# EAGLE board RFfrontend_v4 (EAGLE 7.5.0)
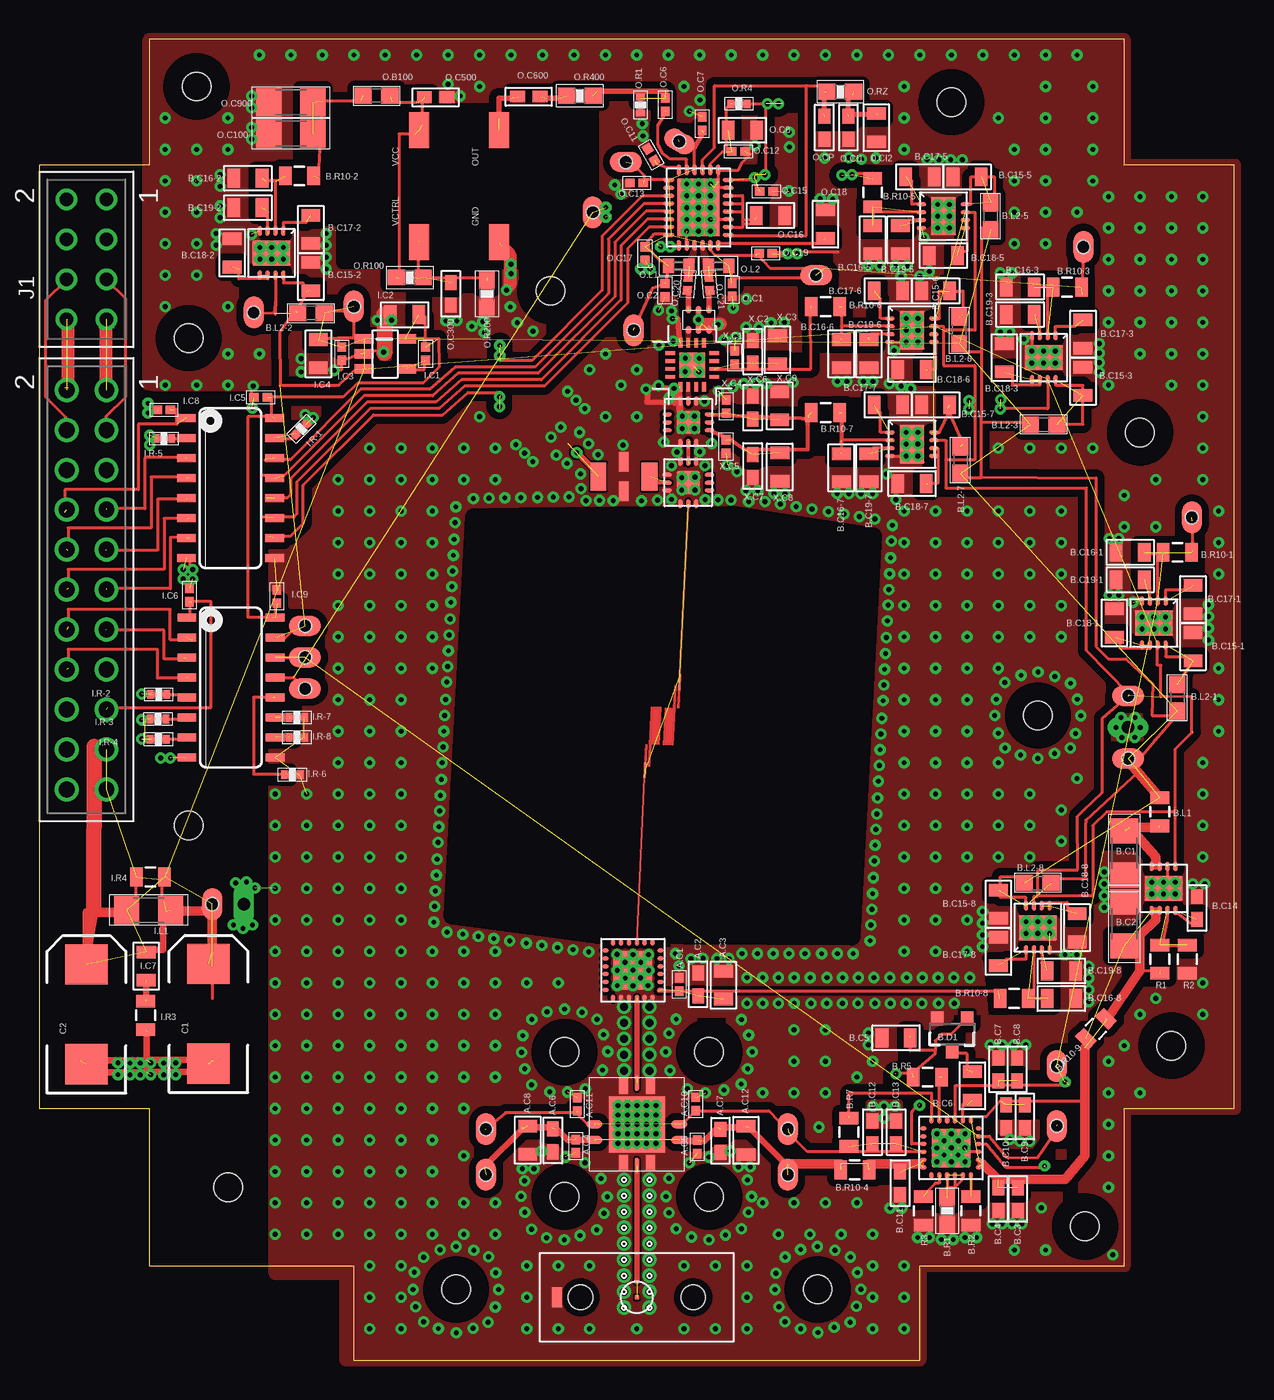
[diagram p2: board, top side]
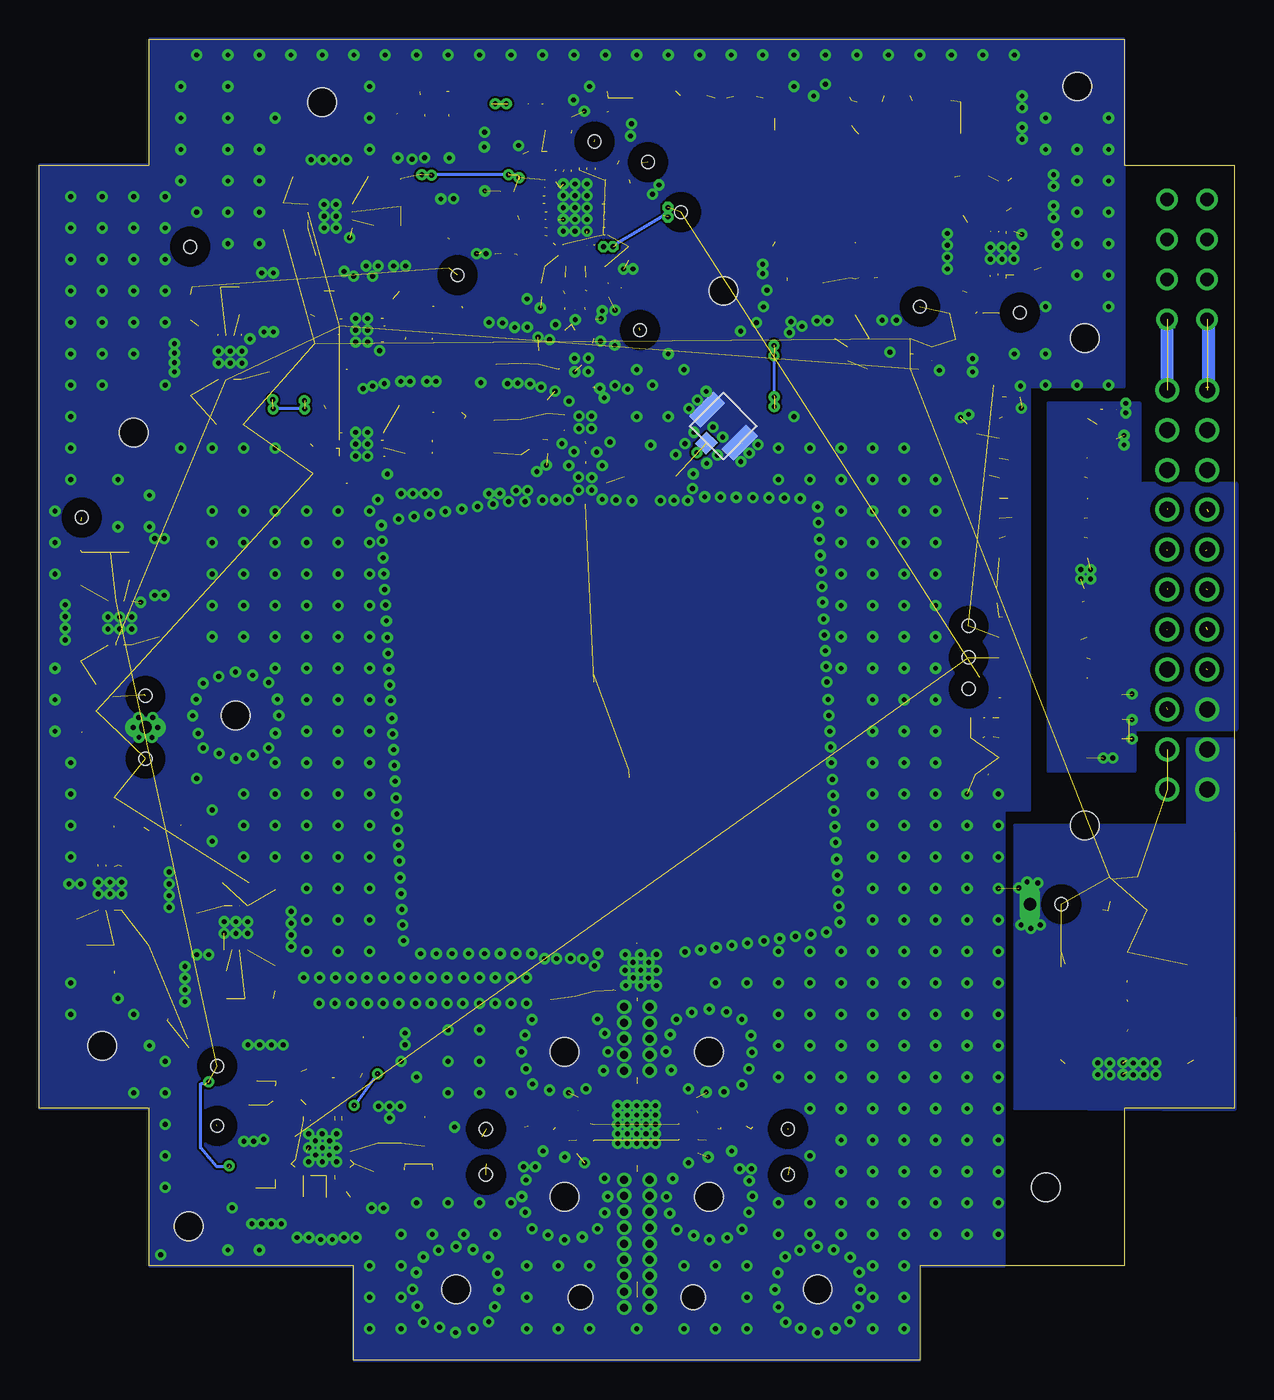
[diagram p3: board, bottom side, seen from below]

Size 76 x 84 mm. Coordinates in mm from the lower left corner, seen from the top.
Outline: 7,76 0,76 0,16 7,16 7,6 20,6 20,0 56,0 56,6 69,6 69,16 76,16 76,76 69,76 69,84 7,84 7,76
Copper layers (1*9*16): Top 0.035mm / dielectric 1.5mm / Route9 0.035mm / dielectric 0.2mm / Bottom 0.035mm
Design rules "default *": minimum track width 10mil, minimum drill 24mil, track to track 5mil, track to pad 5mil, pad to pad 8mil, via to via 8mil, smd to smd 8mil, copper to edge 0mil, drill to drill 8mil, minimum pad ring 10mil, minimum via ring 8mil, stop-mask expansion 4mil, vias tented up to drill 0mil, thermal gap 10mil
tRestrict: area 43.1,58.3 to 44.8,59.5; area 26.2,26.9 to 53,54; 10 lines

## Footprints (pad centres in the part's own frame; a part is rotated, then mirrored left to right if it is on the bottom)
0805 = smd 0.8 x 1.2: 1 -0.9,0; 2 0.9,0
1PIN_B-T-B_TOPPAD = smd 1.27 x 2.032: P$1 0,0 | hole 0.8: 0,0
0402-CAP = smd 0.6 x 0.55: 1 -0.425,0; 2 0.425,0
0603-CAP = smd 0.95 x 0.75: 1 -0.725,0; 2 0.725,0
1206 = smd 1.6 x 1.8: 1 -1.4,0; 2 1.4,0
SOT23-3 = smd 0.8 x 0.9: 1 -0.95,-1; 2 0.95,-1; 3 0,1.1
0603 = smd 1.1 x 1: 1 -0.85,0; 2 0.85,0
0603-RES = smd 1.1 x 1: 1 -0.85,0; 2 0.85,0
EIA7343 = smd 2.55 x 2.7: A 3.17,0; C -3.17,0
0402-RES = smd 0.6 x 0.55: 1 -0.425,0; 2 0.425,0
SLW-104-01-X-D = drill 0.864 pad 1.295: 1 3.81,-1.27; 2 3.81,1.27; 3 1.27,-1.27; 4 1.27,1.27; 5 -1.27,-1.27; 6 -1.27,1.27; 7 -3.81,-1.27; 8 -3.81,1.27
C0402 = smd 0.7 x 0.9: 1 -0.65,0; 2 0.65,0
QFN_28PIN = smd 0.25 x 0.7: P$1 -1.75,-1.9; P$2 -1.25,-1.9; P$3 -0.75,-1.9; P$4 -0.25,-1.9; P$5 0.25,-1.9; P$6 0.75,-1.9; P$7 1.25,-1.9; P$8 1.75,-1.9; P$15 1.75,1.9; P$16 1.25,1.9; P$17 0.75,1.9; P$18 0.25,1.9; P$19 -0.25,1.9; P$20 -0.75,1.9; P$21 -1.25,1.9; P$22 -1.75,1.9 | smd 0.7 x 0.25: P$9 2.4,-1.25; P$10 2.4,-0.75; P$11 2.4,-0.25; P$12 2.4,0.25; P$13 2.4,0.75; P$14 2.4,1.25; P$23 -2.4,1.25; P$24 -2.4,0.75; P$25 -2.4,0.25; P$26 -2.4,-0.25; P$27 -2.4,-0.75; P$28 -2.4,-1.25 | smd 3.65 x 2.65: P$29 0,0
4_PIN_9X14MM = smd 1.27 x 2.286: GND 2.54,-3.556; OUT 2.54,3.556; VCC -2.54,3.556; VCTRL -2.54,-3.556
LP3 = smd 1.6 x 1.6: PAD_GND 0,0 | smd 0.6 x 0.24: PIN1 -1.4,0.75; PIN2 -1.4,0.25; PIN3 -1.4,-0.25; PIN4 -1.4,-0.75; PIN9 1.4,-0.75; PIN10 1.4,-0.25; PIN11 1.4,0.25; PIN12 1.4,0.75 | smd 0.24 x 0.6: PIN5 -0.75,-1.4; PIN6 -0.25,-1.4; PIN7 0.25,-1.4; PIN8 0.75,-1.4; PIN13 0.75,1.4; PIN14 0.25,1.4; PIN15 -0.25,1.4; PIN16 -0.75,1.4
FV1206 = smd 0.61 x 1.25: P$1 0,0.93; P$2 0,-0.93 | smd 1 x 1.8: P$3 -1.625,0; P$4 1.625,0
12PIN_QFN = smd 0.6 x 0.27: P1 -1.35,0.5; P2 -1.35,0; P3 -1.35,-0.5; P7 1.35,-0.5; P8 1.35,0; P9 1.35,0.5 | smd 0.27 x 0.6: P4 -0.5,-1.35; P5 0,-1.35; P6 0.5,-1.35; P10 0.5,1.35; P11 0,1.35; P12 -0.5,1.35 | smd 1.5 x 1.5: P$13 0,0
6_PIN_BALUN = smd 0.35 x 0.5: P$1 0.65,0.65; P$2 0,0.65; P$3 -0.65,0.65; P$4 -0.65,-0.65; P$5 0,-0.65; P$6 0.65,-0.65
BPF_24GHZ = smd 1 x 0.14: IN -2.857,0.953; OUT 2.857,-0.953
24-QFN = smd 0.4 x 0.28: P$1 -1.75,1.25; P$2 -1.75,0.75; P$3 -1.75,0.25; P$4 -1.75,-0.25; P$5 -1.75,-0.75; P$6 -1.75,-1.25; P$13 1.75,-1.25; P$14 1.75,-0.75; P$15 1.75,-0.25; P$16 1.75,0.25; P$17 1.75,0.75; P$18 1.75,1.25 | smd 0.28 x 0.4: P$7 -1.25,-1.75; P$8 -0.75,-1.75; P$9 -0.25,-1.75; P$10 0.25,-1.75; P$11 0.75,-1.75; P$12 1.25,-1.75; P$19 1.25,1.75; P$20 0.75,1.75; P$21 0.25,1.75; P$22 -0.25,1.75; P$23 -0.75,1.75; P$24 -1.25,1.75 | smd 2.5 x 2.5: P$25 0,0
16PIN_SMT = smd 3.55 x 3.55: GNDP 0,0 | smd 1 x 0.5: P1 -2.7,1; P2 -2.7,0; P10 2.7,0; P11 2.7,1 | smd 0.57 x 1.05: P5 -0.86,-2.475; P7 0.86,-2.475; P13 0.86,2.475; P15 -0.86,2.475 | smd 0.25 x 1: P6 0,-2.61; P14 0,2.61
#1-72_BOLT_HOLE = hole 1.804: 0,0
SO16 = smd 0.5 x 1.2: 1 -4.445,-2.8; 2 -3.175,-2.8; 3 -1.905,-2.8; 4 -0.635,-2.8; 5 0.635,-2.8; 6 1.905,-2.8; 7 3.175,-2.8; 8 4.445,-2.8; 9 4.445,2.8; 10 3.175,2.8; 11 1.905,2.8; 12 0.635,2.8; 13 -0.635,2.8; 14 -1.905,2.8; 15 -3.175,2.8; 16 -4.445,2.8
8-LFCSP = smd 0.6 x 0.24: P$1 -1.4,0.75; P$2 -1.4,0.25; P$3 -1.4,-0.25; P$4 -1.4,-0.75; P$5 1.4,-0.75; P$6 1.4,-0.25; P$7 1.4,0.25; P$8 1.4,0.75 | smd 1.6 x 2.44: P$9 0,0
SMA_STRAIGHT_SF2921-61345-1S = smd 0.254 x 0.254: CENTER 0,0 | smd 0.635 x 1.27: OUTER -5.08,0 | hole 1.53: -3.58,0; 3.58,0
SOT-23-5 = smd 0.6 x 1.2: P$1 -0.95,-1.35; P$2 0,-1.35; P$3 0.95,-1.35; P$4 0.95,1.35; P$5 -0.95,1.35
1PIN_B-T-B_GROUND = drill 0.8 pad 1.1 long: P$2 0,0
3_PIN_UMCC = smd 1 x 1.05: P$1 0,-1.525 | smd 1.05 x 2.2: P$2 -1.475,0; P$3 1.475,0
SSW-111-XX-XXX-D = drill 1.016 pad 1.524: 1 12.7,-1.27; 2 12.7,1.27; 3 10.16,-1.27; 4 10.16,1.27; 5 7.62,-1.27; 6 7.62,1.27; 7 5.08,-1.27; 8 5.08,1.27; 9 2.54,-1.27; 10 2.54,1.27; 11 0,-1.27; 12 0,1.27; 13 -2.54,-1.27; 14 -2.54,1.27; 15 -5.08,-1.27; 16 -5.08,1.27; 17 -7.62,-1.27; 18 -7.62,1.27; 19 -10.16,-1.27; 20 -10.16,1.27; 21 -12.7,-1.27; 22 -12.7,1.27

## Placement (x,y rotation side)
0.CI2  [0805]  53.23,78.38 90 top
3.3V  1PIN_B-T-B_TOPPAD  [1PIN_B-T-B_TOPPAD]  37.8,65.5 0 top
A.C1  [0402-CAP]  40.7,23.9 270 top
A.C2  [0603-CAP]  41.9,23.9 270 top
A.C3  [0805]  43.5,23.85 270 top
A.C4  [0402-CAP]  34.11,13.61 90 top
A.C5  [0402-CAP]  41.84,13.57 90 top
A.C6  [0603-CAP]  32.66,13.98 90 top
A.C7  [0603-CAP]  43.31,13.95 90 top
A.C8  [0805]  31.07,14 90 top
A.C10  [0402-CAP]  41.76,16.29 270 top
A.C11  [0402-CAP]  34.2,16.28 270 top
A.C12  [0805]  44.93,13.98 90 top
B.C1  4.7u  [1206]  69,32.25 270 top
B.C2  4.7u  [1206]  69,27.75 90 top
B.C3  4.7u  [0603-CAP]  62.23,10.25 270 top
B.C4  10n  [0603-CAP]  60.98,10.25 270 top
B.C5  10u  [0805]  54.48,20.5 180 top
B.C6  1u  [0805]  59.33,17.45 90 top
B.C7  10n  [0603-CAP]  60.98,18.5 90 top
B.C8  4.7u  [0603-CAP]  62.18,18.5 90 top
B.C9  4.7u  [0603-CAP]  62.68,15.5 270 top
B.C10  10n  [0603-CAP]  61.48,15.5 270 top
B.C11  10n  [0603-CAP]  54.73,11.25 90 top
B.C12  4.7u  [0603-CAP]  52.98,14.5 90 top
B.C13  10n  [0603-CAP]  54.48,14.5 90 top
B.C14  10n  [0603-CAP]  73.62,28.75 90 top
B.C15-1  10u  [0805]  73.38,45.38 90 top
B.C15-2  10u  [0805]  17.27,68.91 90 top
B.C15-3  10u  [0805]  66.38,62.25 90 top
B.C15-5  10u  [0805]  59,75.25 180 top
B.C15-6  10u  [0805]  57,68 180 top
B.C15-7  10u  [0805]  57,60.75 180 top
B.C15-8  10u  [0805]  61,29 270 top
B.C16-1  10u  [0805]  69.38,51.38 180 top
B.C16-2  10u  [0805]  13.27,75.16 180 top
B.C16-3  10u  [0805]  62.38,68.25 180 top
B.C16-5  10u  [0805]  53,71.25 270 top
B.C16-6  10u  [0805]  51,64 270 top
B.C16-7  10u  [0805]  51,56.75 270 top
B.C16-8  10u  [0805]  65,23 0 top
B.C17-1  10u  [0805]  73.38,48.38 90 top
B.C17-2  10u  [0805]  17.27,71.91 90 top
B.C17-3  10u  [0805]  66.38,65.25 90 top
B.C17-5  10u  [0805]  56,75.25 180 top
B.C17-6  10u  [0805]  54,68 180 top
B.C17-7  10u  [0805]  54,60.75 180 top
B.C17-8  10u  [0805]  61,26 270 top
B.C18-1  1u  [0805]  68.38,46.88 90 top
B.C18-2  1u  [0805]  12.27,70.41 90 top
B.C18-3  1u  [0805]  61.38,63.75 90 top
B.C18-5  1u  [0805]  57.5,70.25 180 top
B.C18-6  1u  [0805]  55.5,63 180 top
B.C18-7  1u  [0805]  55.5,55.75 180 top
B.C18-8  1u  [0805]  66,27.5 270 top
B.C19-1  1u  [0805]  69.38,49.62 180 top
B.C19-2  1u  [0805]  13.27,73.29 180 top
B.C19-3  1u  [0805]  62.38,66.5 180 top
B.C19-5  1u  [0805]  54.75,71.25 270 top
B.C19-6  1u  [0805]  52.75,64 270 top
B.C19-7  1u  [0805]  52.75,56.75 270 top
B.C19-8  1u  [0805]  65,24.75 0 top
B.D1  ONSEMI_DIODE_BAT54SL  [SOT23-3]  58.05,20.73 180 top
B.L1  [0805]  71.25,34.88 270 top
B.L2-1  [0603]  72.38,42.12 270 top
B.L2-2  [0603]  17.28,66.59 0 top
B.L2-3  [0603]  63.88,59.5 180 top
B.L2-5  [0603]  60.5,72.75 270 top
B.L2-6  [0603]  58.5,65.5 270 top
B.L2-7  [0603]  58.58,57.24 270 top
B.L2-8  [0603]  63.5,30.34 180 top
B.R1  5k  [0603-RES]  57.73,9.5 270 top
B.R2  10k  [0805]  59.23,9.5 270 top
B.R5  1.6M  [0805]  56.48,18 180 top
B.R7  1.6M  [0805]  51.48,14.5 270 top
B.R10-1  [0805]  72.38,51.38 0 top
B.R10-2  [0805]  16.54,75.31 180 top
B.R10-3  [0805]  65.38,68.25 180 top
B.R10-4  [0805]  51.87,12.11 180 top
B.R10-5  [0805]  53,74.25 270 top
B.R10-6  [0805]  50,67 0 top
B.R10-7  [0805]  50,60.25 0 top
B.R10-8  [0805]  62,23 0 top
B.R10-9  [0805]  67.19,21.08 225 top
C1  [EIA7343]  10.76,22.03 90 top
C2  [EIA7343]  3,22 90 top
I.C1  .1u  [0402-CAP]  24.57,64 270 top
I.C2  1u  [0805]  23.23,66.48 180 top
I.C3  .1u  [0402-CAP]  19.25,64 270 top
I.C4  1u  [0805]  17.75,64 270 top
I.C5  .1u  [0402-CAP]  14.07,61.24 180 top
I.C6  .1u  [0402-CAP]  9.55,48.66 270 top
I.C7  1u  [0805]  6.79,25.06 270 top
I.C8  .1u  [0402-CAP]  7.93,60.44 0 top
I.C9  .1u  [0402-CAP]  15.12,48.58 90 top
I.L1  [1206]  6.95,28.62 180 top
I.R3  [0805]  6.76,21.93 90 top
I.R4  [0805]  7.07,30.72 180 top
I.R-1  [0402-RES]  16.66,59.22 45 top
I.R-2  [0402-RES]  7.59,42.34 0 top
I.R-3  [0402-RES]  7.55,40.78 0 top
I.R-4  [0402-RES]  7.57,39.49 0 top
I.R-5  [0402-RES]  7.93,58.61 0 top
I.R-6  [0402-RES]  16.09,37.23 0 top
I.R-7  [0402-RES]  16.38,40.87 0 top
I.R-8  [0402-RES]  16.38,39.62 0 top
J1  [SLW-104-01-X-D]  3,70 90 top
O-3.3V  1PIN_B-T-B_TOPPAD  [1PIN_B-T-B_TOPPAD]  49.4,69 90 top
O.B100  [0603]  21.45,80.42 0 top
O.C1  [0402-CAP]  44.06,68.07 270 top
O.C2  [0402-CAP]  39.79,68.04 270 top
O.C6  [0402-CAP]  39.81,79.84 270 top
O.C7  [0402-CAP]  42.16,78.64 270 top
O.C8  [0805]  44.72,78.21 0 top
O.C11  [0402-CAP]  38.91,76.66 120 top
O.C12  [0402-CAP]  44.47,76.86 0 top
O.C13  [0402-CAP]  37.99,74.86 0 top
O.C15  [0402-CAP]  46.24,74.32 0 top
O.C16  [0805]  46.5,72.8 0 top
O.C17  [0402-CAP]  38.52,70.37 270 top
O.C18  [0805]  50,72.25 90 top
O.C19  [0402-CAP]  46.2,70.38 180 top
O.C20  [0402-CAP]  41.24,68.45 265 top
O.C21  [0402-CAP]  42.61,68.45 275 top
O.C100  [1206]  16,78 0 top
O.C300  [0603-CAP]  26.18,67.81 270 top
O.C500  [0603-CAP]  25.21,80.31 0 top
O.C600  [0603-CAP]  31.12,80.36 0 top
O.C900  [1206]  16,80 0 top
O.CI1  [0603-CAP]  51.45,78.38 90 top
O.CP  [0603-CAP]  49.93,78.38 270 top
O.L1  [C0402]  40.66,69.59 0 top
O.L2  [C0402]  43.2,69.59 0 top
O.R1  [0402-RES]  38.23,79.82 270 top
O.R4  [0402-RES]  44.49,79.9 0 top
O.R100  [0603-RES]  23.56,68.86 180 top
O.R200  [0603-RES]  28.46,67.81 90 top
O.R400  [0603-RES]  34.38,80.41 180 top
O.RZ  [0603-RES]  50.94,80.67 180 top
R1  [0805]  71.25,25.5 270 top
R2  [0805]  73,25.5 90 top
R3  200  [0805]  56.23,9.5 270 top
U$1  LINEAR_LTC6946  [QFN_28PIN]  41.92,73.3 270 top
U$9  1PIN_B-T-B_TOPPAD  [1PIN_B-T-B_TOPPAD]  37.3,76.2 270 top
U$13  CRYSTEK_601964  [4_PIN_9X14MM]  26.69,74.67 0 top
U$14  HITTITE_HMC369  [LP3]  41.52,63.29 270 top
U$15  MINICIRCUITS_LPF  [FV1206]  37.18,56.19 0 top
U$18  1PIN_B-T-B_TOPPAD  [1PIN_B-T-B_TOPPAD]  40.7,77.5 60 top
U$19  1PIN_B-T-B_TOPPAD  [1PIN_B-T-B_TOPPAD]  66.4,70.8 180 top
U$20  1PIN_B-T-B_TOPPAD  [1PIN_B-T-B_TOPPAD]  69.25,38.25 90 top
U$22  HITTITE_HMC576  [12PIN_QFN]  41.28,59.64 270 top
U$25  1PIN_B-T-B_TOPPAD  [1PIN_B-T-B_TOPPAD]  20,67 0 top
U$26  1PIN_B-T-B_TOPPAD  [1PIN_B-T-B_TOPPAD]  64.7,18.7 0 top
U$28  1PIN_B-T-B_TOPPAD  [1PIN_B-T-B_TOPPAD]  73.3,53.6 0 top
U$29  HITTITE_HMC292  [12PIN_QFN]  41.27,55.81 270 top
U$35  1PIN_B-T-B_TOPPAD  [1PIN_B-T-B_TOPPAD]  16.9,46.7 90 top
U$36  1PIN_B-T-B_TOPPAD  [1PIN_B-T-B_TOPPAD]  13.64,66.62 180 top
U$39  JOHNSON_5500BL15U0100  [6_PIN_BALUN]  41.92,66.16 180 top
U$41  BPF_24GHZ  [BPF_24GHZ]  39.62,40.32 267 top
U$43  HITTITE_HMC383  [24-QFN]  37.75,24.8 270 top
U$44  HITTITE_HMC5445  [16PIN_SMT]  38,15 180 top
U$45  [#1-72_BOLT_HOLE]  9.5,65 0 top
U$51  ANALOG_ADUM162N0BRZ  [SO16]  12.19,42.78 270 top
U$61  ANALOG_LDO_ADM7172  [8-LFCSP]  71.5,30 90 top
U$62  HITTITE_HMC980LP4E  [24-QFN]  57.98,13.5 180 top
U$75  SMA_STRAIGHT_SF2921-61345-1S  [SMA_STRAIGHT_SF2921-61345-1S]  38,4 0 top
U$84  ANALOG_LDO_ADM7150  [8-LFCSP]  70.88,46.88 270 top
U$95  ANALOG_LDO_ADM7150  [8-LFCSP]  14.77,70.41 270 top
U$103  ANALOG_LDO_ADM7150  [8-LFCSP]  63.88,63.75 270 top
U$111  ANALOG_ADUM162N0BRZ  [SO16]  12.16,55.46 270 top
U$113  LINEAR_LDO_LT1761-X  [SOT-23-5]  22,64 270 top
U$119  ANALOG_LDO_ADM7150  [8-LFCSP]  57.5,72.75 0 top
U$127  ANALOG_LDO_ADM7150  [8-LFCSP]  55.5,65.5 0 top
U$135  ANALOG_LDO_ADM7150  [8-LFCSP]  55.5,58.25 0 top
U$143  ANALOG_LDO_ADM7150  [8-LFCSP]  63.5,27.5 90 top
U$151  [RF_FRONT_END_OUTLINE_V1]  36,42 90 top
U$152  1PIN_B-T-B_GROUND  [1PIN_B-T-B_GROUND]  69.25,40.25 90 top
U$153  1PIN_B-T-B_TOPPAD  [1PIN_B-T-B_TOPPAD]  69.25,42.25 270 top
U$154  1PIN_B-T-B_TOPPAD  [1PIN_B-T-B_TOPPAD]  64.7,14.9 180 top
U$155  1PIN_B-T-B_TOPPAD  [1PIN_B-T-B_TOPPAD]  11,29 0 top
U$156  1PIN_B-T-B_GROUND  [1PIN_B-T-B_GROUND]  13,29 0 top
U$157  1PIN_B-T-B_TOPPAD  [1PIN_B-T-B_TOPPAD]  16.9,44.7 270 top
U$158  [#1-72_BOLT_HOLE]  58,80 0 top
U$159  [#1-72_BOLT_HOLE]  32.5,68 0 top
U$160  [#1-72_BOLT_HOLE]  10,81 0 top
U$161  [#1-72_BOLT_HOLE]  33.4,19.6 0 top
U$162  [#1-72_BOLT_HOLE]  70,59 0 top
U$163  [#1-72_BOLT_HOLE]  42.6,19.6 0 top
U$164  [#1-72_BOLT_HOLE]  33.4,10.4 0 top
U$165  [#1-72_BOLT_HOLE]  42.6,10.4 0 top
U$166  [#1-72_BOLT_HOLE]  49.5,4.5 0 top
U$167  [#1-72_BOLT_HOLE]  26.5,4.5 0 top
U$169  TE_UMCC_CONNECTOR  [3_PIN_UMCC]  32.5,59.4 315 bottom
U$170  [#1-72_BOLT_HOLE]  72,20 0 top
U$171  [#1-72_BOLT_HOLE]  63.5,41 0 top
U$172  [#1-72_BOLT_HOLE]  9.5,34 0 top
U$173  [#1-72_BOLT_HOLE]  12,11 0 top
U$174  1PIN_B-T-B_TOPPAD  [1PIN_B-T-B_TOPPAD]  47.6,11.8 180 top
U$175  1PIN_B-T-B_TOPPAD  [1PIN_B-T-B_TOPPAD]  28.4,11.8 0 top
U$176  1PIN_B-T-B_TOPPAD  [1PIN_B-T-B_TOPPAD]  47.6,14.7 0 top
U$177  1PIN_B-T-B_TOPPAD  [1PIN_B-T-B_TOPPAD]  28.4,14.7 0 top
U$178  [#1-72_BOLT_HOLE]  66.5,8.5 0 top
U$180  SSW-111-XX-XXX-D  [SSW-111-XX-XXX-D]  3,49 90 top
U$189  1PIN_B-T-B_TOPPAD  [1PIN_B-T-B_TOPPAD]  16.9,42.7 90 top
U$190  1PIN_B-T-B_TOPPAD  [1PIN_B-T-B_TOPPAD]  35.2,73 0 top
U$191  [CPW_VIA_GUIDE]  38,7.41 180 top
U$192  [CPW_VIA_GUIDE]  38,3.34 180 top
X.C1  [0402-CAP]  44.23,63.77 270 top
X.C2  [0603-CAP]  45.37,64.13 270 top
X.C3  [0805]  46.94,64.26 270 top
X.C4  [0402-CAP]  43.69,60.65 270 top
X.C5  [0402-CAP]  43.67,58.09 270 top
X.C6  [0603-CAP]  45.36,60.58 270 top
X.C7  [0603-CAP]  45.37,56.86 270 top
X.C8  [0805]  47.09,56.8 90 top
X.C9  [0805]  47.08,60.69 90 top

## Tracks (layer width: path | path; a pad name or v marks a point on that pad's centre or on a via)
5V  (1 unrouted)
  Top 0.203: 43.7,75.08 45.48,75.08 | 45.67,74.2 45.48,75.34
6.3V  (11 unrouted)
  Top 0.203: 59.23,15.5 60.23,15.5 61.13,16.5 66.38,16.5 | 71.25,24.75 70,24.75
  Top 0.61: 71,28.5 71,28 70,27 70,24.75 67.86,21.62 67.93,21.68 | 66.48,19.88 66.48,13 65.25,11.5 60.98,11.5 59.98,12.5
12GHZ
  pour Top (no thermals): 41.15,61.16 41.17,61.65 41.38,61.65 41.4,61.16
A-4.8V  (via drill 0.3)  (15 unrouted)
  Top 0.203: 73.38,51.5 73.33,53.36 | 60.98,17.5 65.48,17.5 | 60.98,17.45 58.23,17.45 58.23,15.3 | U$62.P$4 60.23,13.75 61.48,12.25 63.98,12.25
  Bottom 0.203: 63.88,12.3 64.73,12.3 65.23,12.89 65.75,13.5 65.73,17.6 65.38,17.6 65.38,17.65
  other vias: 63.93,12.35 65.23,17.7
A-5V  (5 unrouted)
  Top 0.203: 39.35,23.5 61,23.5
A-VDD  (20 unrouted)
  Top 0.406: 40.75,13.95 42.3,13.95 43.16,14.8 45.14,14.8 47.58,12.37 | 28.3,12.29 30.73,14.73 | 30.66,14.8 32.64,14.8 | 35.35,14 33.6,14 32.85,14.75
  Top 0.61: 55.98,12.5 52.73,12.5 | 50.98,12.5 47.58,12.5
A-VGG  (11 unrouted)
  Top 0.203: U$62.P$16 48.85,13.25 47.85,14.25 48.08,14.25 | 40.94,15.05 40.94,15.07 41.73,15.86 46.39,15.86 47.65,14.55 47.65,15.61 | 35.34,15.05 34.83,15.05 34.15,15.73 29.64,15.73 28.36,14.7
AGND  (via drill 0.3, 0.51)  (60 unrouted)
  Top 0.203: 43.91,74.54 43.88,74.57 42.89,74.57 | 43.17,75.69 43.17,74.95 | 43.78,72.56 43.75,72.54 42.97,72.54 | 41.16,70.91 41.16,71.67 | 43.2,75.69 44.47,75.69 44.72,76.19 45.23,76.7 | 50.81,70.48 47.92,70.48 | 71.75,31.5 71.75,30.5 | U$62.P$3 58.98,13.25 | 63.12,65.25 63.12,64.25 | 54.25,64.75 55,64.75 | 54,57.5 55,57.5 | 18,63 19.23,63 19.23,63.57 20.4,64 21.9,64.31 | 13.5,60.6 13.5,61.9
  Top 0.356: U$39.P$5 U$39.P$2 | 40.73,60.91 38.65,60.91 38.73,61.81 40.7,61.8 40.7,60.85 40.4,60.85 40.41,61.78 | 40.73,64.95 40.62,66.2 | 40.75,60.75 40.72,61.9
  Top 0.406: 6.83,20.91 6.83,19.09 | 6.83,19.09 11.05,19.09 | 6.83,19.09 6.83,19.06 2.61,19.06 | 47.01,70.35 48.02,70.35 | 6.83,20.16 6.83,18.34 | 6.83,18.34 11.05,18.34 | 6.83,18.34 6.83,18.31 2.61,18.31
  Top 0.457: 40.68,61.05 40.76,60.02
  Top 0.813: 29.38,70.86 29.94,70.3 29.94,68.4 | 42.14,65.89 43.3,65.89
  Top 1.016: 21.95,66.5 21.95,64.05
  other vias: 38.24,69.4 37,74.15 36.59,74.74 49.66,73.86 47.59,70.38 47.7,77.15 47.67,74.36 47.69,78.09 45.52,77.24 49.93,76.46 51.49,76.47 53.2,76.46 42.02,80.14 41.34,79.42 38.34,78.64 38.39,77.86 48.2,70.38 50.46,73.85 44.13,66.92 44.97,67.5 40.2,66.73 43.16,65.86 52.29,76.38 40.27,66.24 39.38,66.78 40.32,64.8 39.4,64.54 39.38,61.97 38.58,61.75 43.55,64.91 44.29,65.07 44.96,65.7 45.77,65.68 46.54,65.96 47.39,65.99 41.08,62.86 41.08,63.72 41.97,63.71 41.95,62.86 41.92,73.3 40.35,61.8 41.92,74.05 41.92,74.8 42.67,74.8 42.67,74.05 42.67,73.3 42.67,72.55 42.67,71.8 41.92,71.8 41.92,72.55 41.17,72.55 41.17,71.8 41.17,73.3 41.17,74.05 41.17,74.8 40.88,59.25 40.88,60.03 41.67,60.03 41.67,59.25 42.77,58.28 39.71,58.38 40.07,61.2 43.2,61.63 44.09,61.89 44.8,62.08 45.57,62.14 46.22,62.11 47.92,62.18 43.75,56.93 44.37,56.52 44.94,55.3 45.69,55.3 46.71,55.13 47.42,55.11 38.81,18.41 53.72,15.39 54.42,16.14 53.72,16.14 53.02,16.14 8.68,18.92 7.92,18.89 7.08,18.92 6.42,18.89 5.76,18.89 5,18.92 27.5,65.75 28.3,65.35 28.2,66.05 25.85,66.1 26.55,66.1 21.9,64.1 21.5,66.15 22.4,66.15 16.65,63.7 18.75,62.95 16.65,62.85 13.55,60.55 13.6,61.95 11.25,71.65 11.25,70.9 11.5,72.65 11.5,73.4 11.5,74.65 11.5,75.4 18.25,70.9 18.25,70.15 18.25,71.65 18.25,69.4 13.5,77.65 13.5,78.4 13.5,79.65 13.5,80.4 26,81.15 26.75,80.4 57.21,76.35 56.46,76.35 57.96,76.35 58.71,76.35 53.46,69.6 52.71,69.6 54.46,69.6 55.21,69.6 54.81,68.95 56.01,68.95 56.61,69.25 56.26,71.4 13.51,71.6 51.36,62.25 50.76,62.25 52.41,62.25 53.01,62.25 54.81,61.95 55.41,61.8 54.06,62.1 54.36,64.2 61.11,65.4 61.71,65.4 61.11,69.15 61.86,69.15 62.61,64.95 67.41,64.05 67.41,63.45 67.41,62.85 67.41,64.65 68.06,52.25 68.66,52.25 68.06,48.65 68.66,48.65 74.36,47.3 69.56,48.2 74.36,48.05 74.36,46.55 74.36,45.8 30,69.7 30,69.1 38.81,19.42 38.81,20.44 38.81,21.45 38.81,22.47 37.18,18.41 37.18,19.42 37.18,20.44 37.18,21.45 37.18,22.47 40.55,57.75 42,57.79 42.31,60.99 41.92,66.17 70.03,40.24 69.68,40.88 68.48,40.23 68.8,40.87 68.84,39.6 69.67,39.62 59.99,27.8 59.99,28.55 59.99,27.05 59.99,26.3 67.74,30.3 67.74,30.3 67.74,31.05 67.74,29.55 67.74,28.8 66.74,25.05 66.74,24.3 66.74,23.55 66.74,22.8 65.24,25.8 66.74,25.05 65.99,25.8 73.36,30.3 74.11,30.3 52.74,20.8 52.74,20.05 60.49,20.05 61.24,20.05 61.99,20.05 62.74,20.05 62.99,13.92 62.36,13.92 61.74,14.05 61.24,8.67 60.61,8.67 61.86,8.67 62.49,8.67 59.61,7.8 58.86,7.8 58.11,7.67 57.36,7.67 56.61,7.8 55.86,7.8 54.86,9.67 54.11,9.67 44.46,12.3 45.21,12.3 43.96,13.3 42.59,12.92 41.34,12.55 34.71,12.55 33.46,12.92 31.96,13.3 31.46,12.17 30.71,12.17 33.59,17.05 42.35,17 41.23,17.25 34.73,17.25 43.99,54.69 42.35,54.73 36.5,54.66 38.3,54.65 39.32,54.7 51.48,55.11 50.74,55.1 52.24,55.1 52.99,55.1 53.87,56.35 54.47,54.73 34.41,56.37 33.55,57.04 34.93,58.29 35.53,57.58 37.11,58.2 33.59,61.61 34.14,61.06 34.69,60.51 30.85,57.69 31.39,57.14 30.3,58.23 32.88,57.56 34.36,59 32.54,58.7 33.16,59.34 34.45,55.42 40.2,56.89 42.33,56.89 40.2,54.75 43.16,54.72 40.69,25.07 41.44,25.52 42.21,25.55 43.1,25.54 43.86,25.54 61.42,38.94 60.76,41 61.41,43.1 63.52,43.76 65.59,43.05 66.24,40.99 65.57,38.92 63.5,38.26 62.41,38.49 60.99,39.87 60.86,42.04 62.43,43.56 64.58,43.47 66.02,42.04 65.9,39.85 64.56,38.57 36.15,19.62 35.47,21.68 33.4,22.33 31.32,21.67 30.67,19.58 31.31,17.52 32.46,17.06 30.87,18.52 30.75,20.64 32.3,22.16 34.51,22.12 35.87,20.71 35.81,18.44 39.84,19.6 40.5,21.69 40.04,20.77 40.11,18.41 44.64,17.56 43.55,17.18 45.34,19.6 45.05,18.52 44.66,21.66 45.11,20.68 24.45,2.44 23.78,4.49 24.44,6.55 26.51,7.23 28.57,6.57 29.22,4.49 28.54,2.41 26.52,1.74 25.38,2.01 23.93,3.4 23.86,5.59 25.49,7.01 27.64,6.99 29.04,5.55 29,3.38 27.59,2.02 46.78,4.49 47.44,6.56 49.49,7.23 51.58,6.56 52.26,4.5 51.57,2.42 49.52,1.76 47.42,2.45 47.03,3.39 46.86,5.53 48.42,7.03 50.6,6.99 52.02,5.57 51.96,3.43 50.55,2.1 48.42,2 42.59,7.66 44.66,8.36 45.31,10.4 39.85,10.4 40.5,8.35 41.47,7.83 40.04,9.37 40.05,11.56 43.64,7.96 45.09,9.4 45.04,11.46 35.45,8.29 36.12,10.39 35.72,11.55 33.39,7.66 31.31,8.33 30.64,10.42 30.87,9.4 32.25,7.78 34.38,7.92 35.91,9.34 30.85,11.41 30.4,65.99 31.4,65.45 29.72,68.04 29.95,66.99 45.01,24.33 46.01,24.33 47.01,24.33 48.01,24.33 45.01,22.69 46.01,22.69 47.01,22.69 48.01,22.69 12.49,30.35 13.18,30.42 13.71,30.04 12.95,27.45 13.56,27.68 12.34,27.68 38.84,69.4 57.88,72.75 57.88,73.5 57.13,73.5 57.13,72.75 57.13,72 57.88,72 55.88,65.5 55.88,66.25 55.13,66.25 55.13,65.5 55.13,64.75 55.88,64.75 63.86,64.16 64.61,64.16 64.61,63.41 63.86,63.41 63.11,63.41 63.11,64.16 55.88,58.25 55.88,59 55.13,59 55.13,58.25 55.13,57.5 55.88,57.5 14.78,70.02 15.53,70.02 15.53,70.77 14.78,70.77 14.03,70.77 14.03,70.02 70.88,47.25 71.63,47.25 71.63,46.5 70.88,46.5 70.13,46.5 70.13,47.25 71.5,30.39 72.25,30.39 72.25,29.64 71.5,29.64 70.75,29.64 70.75,30.39 63.5,27.89 64.25,27.89 64.25,27.14 63.5,27.14 62.75,27.14 62.75,27.89 58,13.5 58.01,14.39 57.09,13.49 57.09,12.61 58,12.61 58.87,12.61 58.87,13.5 58.88,14.39 57.09,14.39 57.55,13.05 58.43,13.05 58.45,13.95 57.54,13.94 38.01,14.99 38.01,14.39 38.01,13.79 38.61,13.79 39.21,13.79 39.21,14.39 38.61,14.39 38.61,14.99 39.21,14.99 38.61,15.59 39.21,15.59 39.21,16.19 38.61,16.19 38.01,16.19 37.41,16.19 36.81,16.19 36.81,15.59 36.81,14.99 36.81,14.39 36.81,13.79 37.41,13.79 37.41,14.39 37.41,14.99 37.41,15.59 38.01,15.59 37.75,24.8 36.76,23.82 38.7,23.82 38.76,24.79 38.74,25.79 37.75,25.8 36.75,24.8 36.74,25.8 37.24,25.3 38.25,25.29 37.75,23.81 37.26,24.29 38.23,24.31 17.41,59.94 16.9,60.14 49.02,24.33 53.13,22.69 54.13,22.69 55.13,22.69 56.13,22.69 57.2,22.69 58.2,22.69 49.07,22.69 50.07,22.69 51.07,22.69 52.07,22.69 50.09,24.33 51.09,24.33 52.09,24.33 53.09,24.33 54.1,24.33 55.17,24.33 56.17,24.33 57.17,24.33 58.17,24.33 59.18,24.33 14,83 16,83 18,83 20,83 22,83 24,83 26,83 28,83 30,83 32,83 34,83 36,83 38,83 40,83 42,83 44,83 46,83 48,83 50,83 52,83 54,83 56,83 58,83 60,83 62,83 64,83 66,83 67,81 67,79 67,77 67,75 68,74 70,74 72,74 74,74 74,32 74,34 74,36 74,38 74,56 74,58 74,60 74,62 74,64 74,66 74,68 74,70 74,72 75,40 75,42 75,44 75,50 75,52 75,54 64,81 64,79 64,77 64,75 64,73 64,71 62,71 62,73 62,75 62,77 8,67 8,69 8,71 8,73 8,75 8,77 8,79 10,71 10,73 10,75 10,77 12,77 10,69 8,62 10,62 12,62 12,64 14,64 12,67 72,72 55,77 55,79 55,81 41,81 28,81 12,79 61,79 68,68 68,70 68,72 66,73 68,66 68,62 61,58 63,58 65,58 67,58 70,72 70,64 71,56 69,55 69,53 71,53 74,24 71,23 70,22 69,20 68,19 68,17 68,15 68,13 68,11 70,17 74,22 68.28,6.7 63.73,9.7 64,7 62,7 50,10 52,10 48,10 46,10 46,17 48,17 49.58,14.82 50,17 52,18 53,19 48,19 50,19 50,21 48,21 52.84,26.67 52.89,27.67 52.94,28.67 52.99,29.67 53.05,30.68 53.1,31.75 53.16,32.74 53.21,33.74 53.26,34.74 53.31,35.76 53.37,36.82 53.42,37.82 53.47,38.82 53.53,39.81 53.58,40.83 53.66,41.94 53.71,42.94 53.77,43.94 53.82,44.94 53.87,45.95 53.93,47.02 53.98,48.01 54.03,49.01 54.08,50.01 54.14,51.03 54.19,52.09 54.25,53.09 25.09,27.85 25.14,28.85 25.19,29.85 25.24,30.85 25.3,31.86 25.35,32.92 25.4,33.92 25.46,34.92 25.51,35.92 25.56,36.94 25.62,38 25.67,39 25.72,40 25.77,40.99 25.83,42.01 25.91,43.12 25.96,44.12 26.01,45.12 26.07,46.12 26.12,47.13 26.18,48.19 26.23,49.19 26.28,50.19 26.33,51.19 26.39,52.21 26.44,53.27 26.49,54.27 27.61,54.8 28.61,54.82 29.61,54.84 30.62,54.86 31.69,54.87 32.69,54.89 33.69,54.91 34.76,54.66 35.63,54.69 46.15,54.6 47.14,54.44 48.13,54.29 49.13,54.13 50.18,53.96 51.17,53.81 52.16,53.65 53.15,53.49 45.11,54.61 44.68,25.85 45.68,25.85 46.68,25.85 47.68,25.85 48.69,25.85 49.76,25.85 50.76,25.85 51.76,25.85 40.46,25.85 25.94,27.23 26.93,27.09 27.92,26.95 28.91,26.81 29.92,26.67 30.97,26.52 31.96,26.38 32.95,26.24 33.94,26.1 34.95,25.96 21,16 21,18 21,20 21,22 21,24 21,26 21,28 21,30 21,32 21,34 21,36 21,38 21,40 21,42 21,44 21,46 21,48 21,50 21,52 21,54 21,56 21,58 21,14 21,12 21,10 21,8 21,6 21,4 21,2 17,16 17,18 17,20 17,22 17,24 17,26 17,28 17,30 17,32 17,34 17,36 17,14 17,12 17,10 17,8 15,16 15,18 15,20 15,22 15,24 15,26 15,28 15,30 15,32 15,34 15,36 15,14 15,12 15,10 15,8 19,16 19,18 19,20 19,22 19,24 19,26 19,28 19,30 19,32 19,34 19,36 19,38 19,40 19,42 19,44 19,46 19,48 19,50 19,52 19,54 19,56 19,14 19,12 19,10 19,8 23,16 23,18 23,20 23,22 23,24 23,26 23,28 23,30 23,32 23,34 23,36 23,38 23,40 23,42 23,44 23,46 23,48 23,50 23,52 23,54 23,56 23,58 25,44 25,46 25,48 25,50 25,52 25,54 25,56 25,58 23,14 23,12 23,10 23,8 25,16 25,18 25,20 25,22 25,24 25,26 27,18 27,20 27,22 27,24 27,26 29,18 29,20 29,22 29,24 29,26 25,14 25,12 25,10 25,8 27,10 29,10 29,8 27,8 27,16 27,13 31,24 33,24 27,56 29,56 27,58 29,58 28,60 37,62 38,63 38,60 36,64 35,63 36,60 57,28 57,30 57,32 57,34 57,36 57,38 57,40 57,42 57,44 57,46 57,48 57,50 57,52 57,54 55,28 55,30 55,32 55,34 55,36 55,38 55,40 55,42 55,44 55,46 55,48 55,50 55,52 55,54 59,28 59,30 59,32 59,34 59,36 59,38 59,40 59,42 59,44 59,46 59,48 59,50 59,52 59,54 55,26 57,26 59,26 61,32 61,34 61,36 63,36 63,34 63,32 65,33 65,35 66,37 61,38 63,46 63,48 63,50 63,52 63,54 61,44 61,46 61,48 61,50 61,52 61,54 65,46 65,48 65,50 65,52 65,54 72,70 72,68 72,66 70,66 70,68 70,70 72,64 72,62 23,6 23,4 23,2 45,2 45,4 45,6 47,8 49,8 51,8 53,8 55,6 53,4 55,4 55,2 53,2 31,2 31,4 31,6 53,6 38.81,7.41 38.81,8.42 38.81,9.44 38.81,10.46 38.81,11.47 38.81,6.39 38.81,5.38 38.81,4.36 38.81,3.34 37.18,7.41 37.18,8.42 37.18,9.44 37.18,10.46 37.18,11.47 37.18,6.39 37.18,5.38 37.18,4.36 37.18,3.34 33,6 35,6 41,6 43,6 41,2 35,2 38,2 33,2 43,2 41.7,55.34 41.7,56.15 40.86,56.13 40.86,55.34 8.68,18.17 7.92,18.14 7.08,18.17 6.42,18.14 5.76,18.14 5,18.17
  pour Top (isolate 0.457, no thermals): 33.73,79.18 38.79,79.18 38.86,77.16 36.4,77.15 36.34,75.34 37.38,75.34 37.38,74.42 34.27,74.42 34.27,77.78 33.73,77.78
  pour Top (no thermals): 46.92,72.04 47.92,72.04 47.92,75.04 46.92,74.04
  pour Top (no thermals): 44.55,64.01 44.6,64.9 45.48,65.2 44.6,66.1
  pour Top (no thermals): 40.91,61.28 40.88,61.55 40.58,61.55 40.58,60.98
  pour Top (isolate 0.457, no thermals): 67.5,28.5 70,28.5 70,29 70.5,29.25 72.5,29.25 73,29 73,24.5 74.75,25.5 74.75,34 74,33 74,32 72.5,30.75 70.5,30.75 70,31 70,31.5 67.5,31.5
  pour Top (no thermals): 54.73,15 52.73,15 52.73,16.5 54.73,16.5
  pour Top (isolate 0.457, no thermals): 61.88,68.75 61.88,65.25 63.12,65.25 63.12,64.45 67.38,64.45 67.38,63.05 62.77,63.05 62.27,63.85 60.88,64.05 60.88,68.75
  pour Top (isolate 0.457, no thermals): 52.5,70.75 56,70.75 56,72 56.8,72 56.8,76.25 58.2,76.25 58.2,71.65 57.4,71.15 57.2,69.75 52.5,69.75
  pour Top (isolate 0.457, no thermals): 50.5,63.5 54,63.5 54,64.75 54.8,64.75 54.8,69 56.2,69 56.2,64.4 55.4,63.9 55.2,62.5 50.5,62.5
  pour Top (isolate 0.457, no thermals): 50.5,56.25 54,56.25 54,57.5 54.8,57.5 54.8,61.75 56.2,61.75 56.2,57.15 55.4,56.65 55.2,55.25 50.5,55.25
  pour Top (isolate 0.457, no thermals): 65.5,22.5 65.5,26 64.25,26 64.25,26.8 60,26.8 60,28.2 64.6,28.2 65.1,27.4 67.5,30.2 67.5,25.5
  pour Top (isolate 0.457, no thermals): 68.88,51.88 68.88,48.38 70.12,48.38 70.12,47.58 74.38,47.58 74.38,46.17 69.78,46.17 69.28,46.98 67.88,47.17 67.88,51.88
  pour Bottom (no thermals): 14,34 14,16 -0.04,15.92 0,39.5 3,39.5 3,34
  pour Bottom (no thermals): 14.62,5.97 14.62,34.97 13,35 13,61.9 7,61.9 7,84 69,84 69,76 76,76 76,16 69,16 69,6 56,6 56,0 20,0 20,6
  pour Top (isolate 0.457, no thermals): 7,84 69,84 69,76 76,76 76,16 69,16 69,6 56,6 56,0 19.5,0 19.5,5.5 15,5.5 15,62 7,62
  pour Top (isolate 0.127, no thermals): 36.73,16.38 38.87,16.38 38.87,23.84 36.73,23.84
  pour Top (isolate 0.203, no thermals): 41.75,60.75 41.75,61.16 43.06,61.84 43,60.5 42.28,60.41 42.25,58.75 43,58.25 43,56.75 39.81,56.91 39.3,57.67 39,60.75
  pour Top (isolate 0.127, no thermals): 27.4,54.36 39.69,54.49 43.68,54.48 43.37,56.65 40.06,56.65 40.06,57.67 36.51,57.67 33.46,60.21 30.92,57.67
  pour Top (isolate 0.203, no thermals): 34.4,26.43 59.9,25.43 60.25,22.03 34.4,21.76
  pour Top (isolate 0.127, no thermals): 36.48,2.58 39.52,2.58 39.52,13.76 36.48,13.76
CS  (2 unrouted)
  Top 0.203: 40.21,73.55 38.46,73.55 36.2,71.29 36.2,67.84 31.52,63.16 26.44,63.16 24.82,61.74 20.44,61.74 15.97,57.27 14.36,57.27
ISO-3.3V  (7 unrouted)
  Top 0.203: 23.25,65 25.4,64.97 25.43,63.16 24.41,62.15 20.25,62.12 19.32,61.25 14.75,61.25 14.75,60 | 14.75,60 14.75,59.75 | 14.75,60 13.25,60 13.25,47.25 14.75,47.25
ISO-BOT-VCC  (2 unrouted)
  Top 0.203: 4.32,41.52 10.92,41.52 10.92,48.25 9.68,48.25 9.68,48.23 | I.C6.2 9.55,47.39 U$51.1
ISO-TOP-VCC  (3 unrouted)
  Top 0.203: 1.63,53.94 1.63,55.36 6.3,55.36 6.3,59.53 8.74,59.53 8.74,60.44 8.54,60.44
LDO-EN  (18 unrouted)
  Top 0.203: 72.19,34.87 67.89,34.88 | 67,34 67,29.53 63.52,29.53 | 63.25,28.88 63.25,29.5 63.5,29.5 63.52,29.53 | 63.52,29.53 63.5,31.17 66.03,31.18 66.01,34.57 66.4,34.97 67.6,36.1 67.6,40.8 U$153.P$1 | U$36.P$1 14.98,66.59 | 15.02,69.08 15.04,67.5 | 15.04,67.5 14.95,66.59 | 15.04,67.5 15,66.5 | 15.98,66.6 16.26,66.6 16.05,66.37 16.05,66.41 15.29,65.34 15.3,62 19.04,62 20.09,63 | 72.25,31.52 72.26,38.87 73.31,39.94 | 73.3,39.91 73.3,42.2 71.33,42.19 71.33,44.19 71.12,44.19 71.12,45.6 | 69.33,42.34 69.33,42.31 | 67.91,34.87 66.98,34.01
MCU-CS  (2 unrouted)
  Top 0.203: 9.35,57.39 6.71,57.39 6.71,54.14 4.27,54.14
MCU-GND  (via drill 0.3)  (8 unrouted)
  Top 0.203: 7.52,60.44 v6.91,60.24
  other vias: 6.91,60.85 9.76,50.28 9.15,50.28 9.15,49.67 9.76,49.67 6.5,42.36 6.5,40.73 6.5,39.51 8.33,38.29 7.72,38.29 7.01,58.21 7.01,58.82
  pour Bottom (isolate 0.305, no thermals): -0.18,55.75 5.97,55.75 5.97,60.85 11.87,60.85 11.87,37.47 6.3,37.47 6.3,40.12 -0.18,40.12
MCU-LDO-EN  (2 unrouted)
  Top 0.203: 9.75,45.81 8.33,45.81 8.33,47.74 1.83,47.74 1.83,46.63
MCU-MUTE  (2 unrouted)
  Top 0.203: 9.35,43.37 7.52,43.37 7.52,45.2 1.83,45.2 1.83,43.98
MCU-PA-EN  (2 unrouted)
  Top 0.203: 9.15,44.59 7.93,44.59 7.93,46.42 4.27,46.42
MCU-SCLK  (2 unrouted)
  Top 0.203: 9.55,56.18 7.11,56.18 7.11,52.92 1.83,52.92 1.83,51.5
MCU-SDI  (2 unrouted)
  Top 0.203: 9.35,54.75 7.52,54.75 7.52,51.5 4.27,51.5
MCU-SDO  (2 unrouted)
  Top 0.203: 9.55,53.53 7.93,53.53 7.93,50.28 1.83,50.28 1.83,49.06
MCU-STAT  (2 unrouted)
  Top 0.203: 9.55,52.31 8.33,52.31 8.33,49.06 4.27,49.06
MUTE  (via drill 0.3)  (7 unrouted)
  Top 0.203: 40.74,70.91 v40.12,70.81 39.32,70.91 | U$51.13 16.18,43.42 U$189.P$1
  Bottom 0.203: 36,73.3 36.3,72.8 39.3,71
  other vias: 39.52,70.81 36.02,73.31 36.02,72.71
N$1  (4 unrouted)
  Top 0.203: 42.69,75.59 42.69,76.1 43.45,76.86 43.7,76.86 43.7,79.65 43.96,79.91
N$2  (5 unrouted)
  Top 0.203: 43.96,74.07 44.72,74.07 44.72,73.56 | 44.72,73.56 44.72,73.05 | 44.72,73.05 44.72,72.54 | 44.72,72.54 44.72,72.29 | 44.72,72.29 44.72,72.03 43.7,72.03 | 43.96,73.56 44.72,73.56 | 43.7,73.05 44.72,73.05 | 44.72,72.54 45.48,72.54 | 44.72,72.29 45.23,72.29
N$3  (2 unrouted)
  Top 0.356: 41.28,68.09 41.28,66.94
N$4  (3 unrouted)
  Top 0.305: 51.76,80.47 51.45,80.47 51.45,79.25 53.28,79.25
N$5  (4 unrouted)
  Top 0.203: 43.7,71.53 48.78,71.53 48.78,81.05 | 42.18,75.59 42.18,76.35 42.94,77.11 42.94,81.05 48.78,81.05 | 48.78,81.05 49.8,81.05 49.93,80.67
  Top 0.305: 49.93,79.25 49.93,80.67 49.93,80.77
N$6  (2 unrouted)
  Top 0.203: 43.3,71.04 49.9,71.04 49.9,71.29
N$7  (1 unrouted)
  pour Top (no thermals): 41.19,69.84 41.57,70.81 41.79,70.67 41.57,69.3
N$8  (1 unrouted)
  pour Top (no thermals): 42.28,69.31 42.06,70.67 42.29,70.81 42.65,69.81
N$9  (2 unrouted)
  Top 0.356: 42.58,67.83 42.58,66.93
N$10
  pour Top (no thermals): 41.17,64.93 41.11,65.52 41.44,65.52 41.38,64.93
N$11  (2 unrouted)
  Top 0.203: 40.66,75.84 39.89,75.84 39.27,76.06
N$12  (2 unrouted)
  Top 0.203: 41.16,75.84 41.16,76.37 40.15,76.38 39.65,76.76 39.34,77.37 39.34,78.53 39.89,79.4
N$13  (3 unrouted)
  Top 0.356: 35.5,80.7 39.85,80.71
N$14  (6 unrouted)
  Top 0.203: 23.89,77.97 22.88,77.97 22.88,68.55 22.9,68.8 | 24.35,80.11 24.35,78.53 | 22.43,80.03 22.43,80 24,80
N$15  (5 unrouted)
  Top 0.203: 24.09,71.06 24.09,68.78 | 23.89,68.83 28.46,68.83
N$16  (2 unrouted)
  Top 0.356: 29.48,78.99 29.23,78.99 29.23,80.26 29.99,80.26
N$17  (2 unrouted)
  Top 0.27: 41.27,57.03 41.28,58.41
N$18  (2 unrouted)
  Top 0.356: 33.03,80.26 32.27,80.26
N$19
  Top 0.203: 43.91,69.49 44.11,68.57
N$20  (1 unrouted)
N$21
  Top 0.203: 51,75.5 53,75.5
N$22
  Top 0.203: 44.11,68.83 49.91,68.83
N$23
  Top 0.203: 43,23.4 44,23.4
N$24
  Top 0.203: 15.5,75 14.4,75.05
N$26  (1 unrouted)
N$27  (3 unrouted)
  Top 0.14: 40.74,43.61 41.27,54.25 | 38,26.52 38.49,37.06
N$28  (2 unrouted)
  Top 0.356: 38,22.85 38,18
N$29  (2 unrouted)
N$30  (1 unrouted)
N$31
  Top 0.203: 69.97,38.28 70.94,39.42 72.54,41.25
N$32  (1 unrouted)
N$33
  Top 0.27: 40.01,55.81 38.75,55.81
N$34  (via drill 0.3)
  Top 0.356: 34.4,57.5 v34.18,57.72 35.43,56.47
  Bottom 0.356: 33.4,58.5 v34.18,57.72
N$35  (2 unrouted)
  Top 0.203: 57.23,11.5 57.23,11.25 56.98,11.25 56.48,10.75
N$36  (2 unrouted)
  Top 0.203: 51.48,15.5 51.48,17 56.73,17 56.73,15.5
N$37  (via drill 0.3)  (5 unrouted)
  Top 0.203: U$62.P$15 55.48,13.75 55.48,15.8 55.78,16.2 v55.98,16.2 | 55.48,18.25 54.48,18.25 | 55.48,18.25 56.98,19.5 56.98,19.7 | 55.48,18.25 55.73,18.5 | 56.98,19.7 55.38,19.7 55.38,20.6 | B.D1.1 57.98,20.72 57.38,20.72 56.98,20.32 56.98,19.7
  Bottom 0.203: 55.93,16.2 54.48,18.25
  other vias: 54.48,18.2
N$39  (2 unrouted)
  Top 0.203: 57.23,15.5 57.23,18
N$40
  Top 0.203: 15,48 15,47.25
N$42  (2 unrouted)
  Top 0.203: 58.73,15.3 58.73,16.25 59.03,16.25
N$43  (1 unrouted)
  Top 0.203: 58.98,18.5 58.98,19.5 58.05,19.5 B.D1.3
N$44  (3 unrouted)
N$45  (1 unrouted)
N$46  (1 unrouted)
N$47  (2 unrouted)
N$48  (1 unrouted)
N$49  (2 unrouted)
N$50  (3 unrouted)
  Top 0.203: 15.52,68.91 15.52,68.52 16.75,68.52 17,67.93 16.33,66.68
N$51  (1 unrouted)
N$52  (1 unrouted)
N$53  (3 unrouted)
  Top 0.203: 14.54,68.8 14.54,68.78 12.71,68.78 12.71,69.34 12.78,69.34
N$54  (2 unrouted)
  Top 0.203: 14.54,71.65 14.54,73.02 14.46,73.1
N$55  (3 unrouted)
  Top 0.203: 15.02,71.75 15.02,74.98 14.41,74.98
N$56  (2 unrouted)
N$57  (2 unrouted)
N$58  (2 unrouted)
  Top 0.203: 64.62,65.25 64.62,65.75 65.88,65.75
N$59  (2 unrouted)
N$60  (1 unrouted)
N$61  (2 unrouted)
N$62  (1 unrouted)
N$63  (1 unrouted)
N$64
  Top 0.203: U$180.3 4.27,60.04 5.49,61.26 5.49,67.51 J1.5
N$65
  Top 0.203: 15.4,45.9 15.6,45.9 16.4,46.7
N$66  (2 unrouted)
  Top 0.203: 15.52,71.78 15.52,72.36 16.97,72.36
N$67
  Top 0.203: 15.4,44.7 16.2,44.7
N$68
  Top 0.203: 24.29,66.38 24.53,66.38 24.53,64.65
N$69  (2 unrouted)
N$70  (1 unrouted)
N$71  (2 unrouted)
N$72  (3 unrouted)
  Top 0.203: 56.75,66.25 57.25,66.25 57.25,68 58.75,68 58.75,66.5
N$73  (2 unrouted)
  Top 0.203: 54.25,66.25 53.5,66.25 53.5,67.5
N$74  (3 unrouted)
  Top 0.203: 57,65.25 57,63 56.5,63
N$75
  Top 0.203: I.R-5.2 9.34,58.61 U$111.2
N$76  (3 unrouted)
  Top 0.203: 54,65.75 51,65.75 | 51,65.75 51,65 | 51,67 51,65.75
N$77  (3 unrouted)
  Top 0.203: 56.75,59 57.25,59 57.89,60.32 57.75,60.5 58.75,58.25
N$78  (1 unrouted)
N$79  (3 unrouted)
  Top 0.203: 57.14,58 57.14,55.75 56.5,55.75
N$80  (1 unrouted)
N$81  (4 unrouted)
  Top 0.203: 54.25,58.5 51,58.5 51,57.75
  Top 0.254: 51,60.25 51,58.38
N$82  (2 unrouted)
N$83  (1 unrouted)
N$84  (2 unrouted)
N$85  (1 unrouted)
N$86  (2 unrouted)
N$88
  Top 0.203: 63.62,65 63.62,65.75 63.38,66.25
N$89
  Top 0.203: 63.12,62.25 63.12,62 | 63.12,62 61.88,62 61.88,62.75 | 63.62,62.25 63.62,62 63.12,62
N$91
  Top 0.203: 71.75,28.5 71.75,28 71.38,26.38 73,26.38
N$92
  Top 0.203: 64.88,59.5 66.38,59.5 66.38,62 64.62,62 64.62,62.25
N$93
  Top 0.203: 64.12,65 64.12,68.25 63.38,68.25
N$94
  Top 0.203: 72.25,28.5 73.25,27.75 73.5,27.75
N$95  (3 unrouted)
N$97
  Top 0.61: 69.41,37.93 71.11,35.94
N$99
  Top 0.61: 5.46,28.53 5.46,28.48 3.05,28.48 3.05,24.98 2.74,24.98
N$100
  Top 0.203: 59.23,11.75 59.23,10.5
N$103
  Top 0.203: 57.73,11.5 57.73,11 58.23,11 | 58.23,11.75 58.23,11 | 58.73,11.75 58.73,11.5 58.23,11
N$105
  Top 0.203: 15.24,58.61 16.16,58.61 16.16,58.82
N$106  (1 unrouted)
  Top 0.813: 1.83,61.87 1.83,66.13
  Bottom 0.813: 1.63,61.87 1.63,66.13
N$107  (via drill 0.6)
  Top 0.813: v4.27,61.66 v4.27,66.13
  Bottom 0.813: v4.27,61.66 v4.27,66.13
N$108
  Top 0.203: 57.28,18.05 57.38,17.95
N$116  (2 unrouted)
  Top 0.406: 6.8,24.01 6.8,22.92 6.91,22.92
N$117  (1 unrouted)
N$118
  Top 0.203: 56,72.5 55.25,72.5 55.25,72
N$119
  Top 0.203: 56.25,73 53,73 53,72.25
N$120
  Top 0.203: 59,72.5 59,70.5 58.5,70.5
N$121  (via drill 0.3)  (2 unrouted)
  Top 0.203: 69.34,42.33 66.59,45.13 66.59,55.46 57.64,55.47 57.65,57.25 | 64.12,62.5 64.12,60.5 v61.12,60.5 | 58.88,73 59.5,73 59.5,65.5 57.5,65.5 | 57,65.75 57.5,65.75 57.5,65.5 | 57.5,65.5 57.5,63.25 59.48,63.25 59.48,60.5 | 59.48,60.5 59.49,57.25 57.65,57.25 | 56.75,58.5 57.65,58.5 57.65,57.25 | v59.12,60.5 59.48,60.5
  Bottom 0.203: v59.12,60.5 v61.12,60.5
  other vias: 61.15,61.09 59.14,61.03
N$122
  Top 0.203: 59,73.5 59.25,73.5 59.25,75.25 60.75,75.25 60.75,73.75
N$123
  Top 0.203: 45.5,75 45.75,75.25 46.25,75.5
N$124
  Top 0.203: U$180.4 1.69,59.97 0.41,61.26 0.41,67.41 J1.6
N$125
  Top 0.203: 60.75,72 59.91,72 59.91,64.12 | 59.91,64.12 59.89,56.12 | 58.88,64.12 59.91,64.12 | 59,56.12 59.89,56.12 | 59.89,56.12 59.79,56.16 67.2,56.1 67.2,45.4 68,44.6 69.1,44.6 70.8,43 70.76,41 72,40.99 72.38,40.99
N$126
  Top 0.203: 62.75,59.62 59.91,59.63
N$129
  Top 0.203: 56.25,73.5 55.5,73.5 55.5,75
N$131
  Top 0.61: 3,26 3.46,28.57
  Top 1: 3.46,28.57 3.49,39.04
N$134
  Top 0.203: 9.55,49.27 9.55,49.67
N$135
  Top 0.203: 9.35,50.89 9.55,50.89 9.55,50.49
N$136
  Top 0.203: I.R-2.2 9.19,42.34 U$51.5
N$137
  Top 0.203: 38.9,69.3 38.4,69.6 38.5,69.6
N$138
  Top 0.203: I.R-4.2 9.27,39.49 U$51.7
N$139
  Top 0.203: I.R-3.2 9.29,40.78 U$51.6
N$140
  Top 0.203: 54.25,58 53,58 53,57.5
N$142
  Top 0.203: 54,59 53.5,59 53.5,60.25
N$144
  Top 0.203: 63.25,26.12 63.25,23 64.38,23
N$145
  Top 0.203: 62.75,26.12 62.75,25.5 61.5,25.5
N$146
  Top 0.203: 63.75,26.12 63.75,25.25 64.12,25.25
N$147
  Top 0.203: 63.75,29.12 65.38,29.12 65.38,28.62 65.62,28.62
N$148  (2 unrouted)
  Top 0.203: 14.84,42.16 13.62,42.16 13.62,37.28 15.65,37.28 15.65,37.08
N$149
  Top 0.203: 62.75,28.88 62.75,29.42 61.12,29.42 61.12,30.75 62.88,30.75
N$150
  Top 0.203: 70.62,48.25 70.62,49.12 70.12,49.12
N$151
  Top 0.203: 71.12,48.25 71.12,51.25 70.12,51.25
N$152
  Top 0.203: 71.62,48.25 71.62,49 73.12,49
N$153
  Top 0.203: 71.62,45.5 71.62,44.75 73.5,44.75 72.5,43.12 72.38,42.88
N$154
  Top 0.203: 23.5,63 24.5,63 24.5,63.5
N$155
  Top 0.203: 70.62,45.25 68.75,45.25 68.75,45.75 68.62,45.75
N$156
  Top 0.203: 64.5,30.62 66.54,30.62 66.54,34.17 66.54,34.33 69.94,37.48
N$157
  Top 0.203: 23.5,65 24.5,65 24.5,64.5
N$158
  Top 0.406: 7.87,28.18 7.87,26.09 6.6,26.09
N$159
  Top 0.203: 18.25,66.5 18.25,66.75 20,66.75 20,65 19,65 | 18,65 19,65 | 19,65 19,64.5 19.25,64.5
N$160  (2 unrouted)
  Top 0.203: 15.34,40.86 15.88,40.86
N$161
  Top 0.203: 39.8,71.6 39.1,71.6 38.51,70.9
N$162  (2 unrouted)
  Top 0.203: 15.32,39.67 15.85,39.67 15.85,39.64
N$163
  Top 0.203: 8.94,43.58 8.94,43.37
N$164
  Top 0.203: 6.12,30.62 6.12,29.09 6.14,29.09
N$166
  Top 0.203: 8.94,40.73 8.94,40.94
N$167
  Top 0.203: 9.15,39.51 9.15,39.72
N$168
  Top 0.203: 7.32,42.36 6.71,42.36
N$169  (1 unrouted)
  Top 0.203: 7.11,39.31 6.71,39.31 | 6.71,40.73 7.11,40.73
N$170
  Top 0.203: 9.15,38.29 7.72,38.29
N$171
  Top 0.203: 39.8,69.9 39.51,69.9 38.7,70.7
N$700  (1 unrouted)
  Top 0.203: U$127.P$3 52.9,65.25 52.7,65.05
O-3.3V  (24 unrouted)
  Top 0.203: 66.38,67.75 U$19.P$1 | 41.67,75.84 41.67,77.11 40.66,77.11 40.66,77.62 | 40,75.06 38.48,75.06 38.47,75.36 37.71,76.12 | 42.69,70.94 42.69,70.61 42.97,70.28 45.58,70.28 | 45.63,70.35 46.47,69.44 49.94,69.44 | 39.01,68.17 39.84,68.52 40.05,69.59 | 39.01,68.19 37.84,65.67 37.39,65.52 | 40.16,71.55 39.87,71.55
  Top 0.305: 41.67,77.11 42.19,78.04
O-5V  (via drill 0.3)  (13 unrouted)
  Top 0.203: 53.3,75.05 53.05,75.15 | 46.2,75.5 46.2,79.9 | 44.9,79.9 47.25,79.9
  Bottom 0.203: 45.55,75.4 51.77,75.39
  other vias: 46.3,79.9 47,79.9 46.15,75.4 45.5,75.2 51.67,75.4 51.05,75.35
PA-EN  (3 unrouted)
  Top 0.203: U$62.P$5 60.43,14.25 61.53,12.9 63.48,12.88 64.86,14.9 64.73,14.98
REF-3.3V  (4 unrouted)
  Top 0.203: 17.77,75.23 18.02,80.08 20.47,80.08
RFOUT  (2 unrouted)
  Top 0.356: 38,11.98 38,5
SCLK  (2 unrouted)
  Top 0.203: 40.08,73.07 38.58,73.07 36.6,71.09 36.6,67.64 31.73,62.76 26.65,62.76 25.02,61.34 20.64,61.34 15.57,56.26 14.21,56.26
SDI  (2 unrouted)
  Top 0.203: 40.11,72.56 38.69,72.56 37.01,70.89 37.01,67.43 31.93,62.35 26.85,62.35 25.22,60.93 20.85,60.93 15.97,56.05 15.97,55.04 15.77,54.83 14.42,54.83
SDO  (2 unrouted)
  Top 0.203: 40.16,72.06 38.79,72.06 37.42,70.68 37.42,67.23 32.13,61.95 27.05,61.95 25.43,60.52 21.05,60.52 16.38,55.85 16.38,53.82 16.18,53.61 14.17,53.61
STAT  (via drill 0.3)  (8 unrouted)
  Top 0.203: 40.01,74.06 39.98,74.04 38.33,74.04 35.79,71.5 35.79,68.04 31.32,63.57 29.29,63.57 | 14.56,52.39 15.97,52.39 16.78,53.21 16.78,55.65 21.25,60.12 25.63,60.12 27.26,61.54 29.09,61.54 29.29,61.34
  Bottom 0.203: 29.26,60.52 29.26,64.26
  other vias: 29.26,61.26 29.26,60.65 29.29,63.88 29.29,64.54
VBAT  (19 unrouted)
  Top 0.203: 11,25 11,23
VBAT_DIRTY  (6 unrouted)
  Top 0.203: 7.8,30.56 7.8,29.17 7.92,29.17
  Top 0.61: 11,26 11,28.58 8.05,28.58
VIN  (4 unrouted)
  Top 0.61: 71,31.5 71,32 69.34,33.89 71.24,33.87
X1-5V  (5 unrouted)
  Top 0.203: 42.98,63.03 49.07,63.03 49.05,66.89
X2-5V  (10 unrouted)
  Top 0.254: 42.61,60.14 49.29,59.89 48.96,59.91 | 42.61,59.14 43.98,58.56 44.82,57.93 48.88,57.92 48.88,60.03 48.85,59.56

## Text on the board
Reference: 5V | 3.3V | 3.3V | 5V | MUTE | 3.3V | 3.3V | LDO-EN | VBAT | 3.3V | 4.8V | LDO-EN | PA-EN | MUTE | LDO-EN | GND | VBAT | 4.8V | PA-EN